# EAGLE design esp-wroom-test (EAGLE 9.6.2)
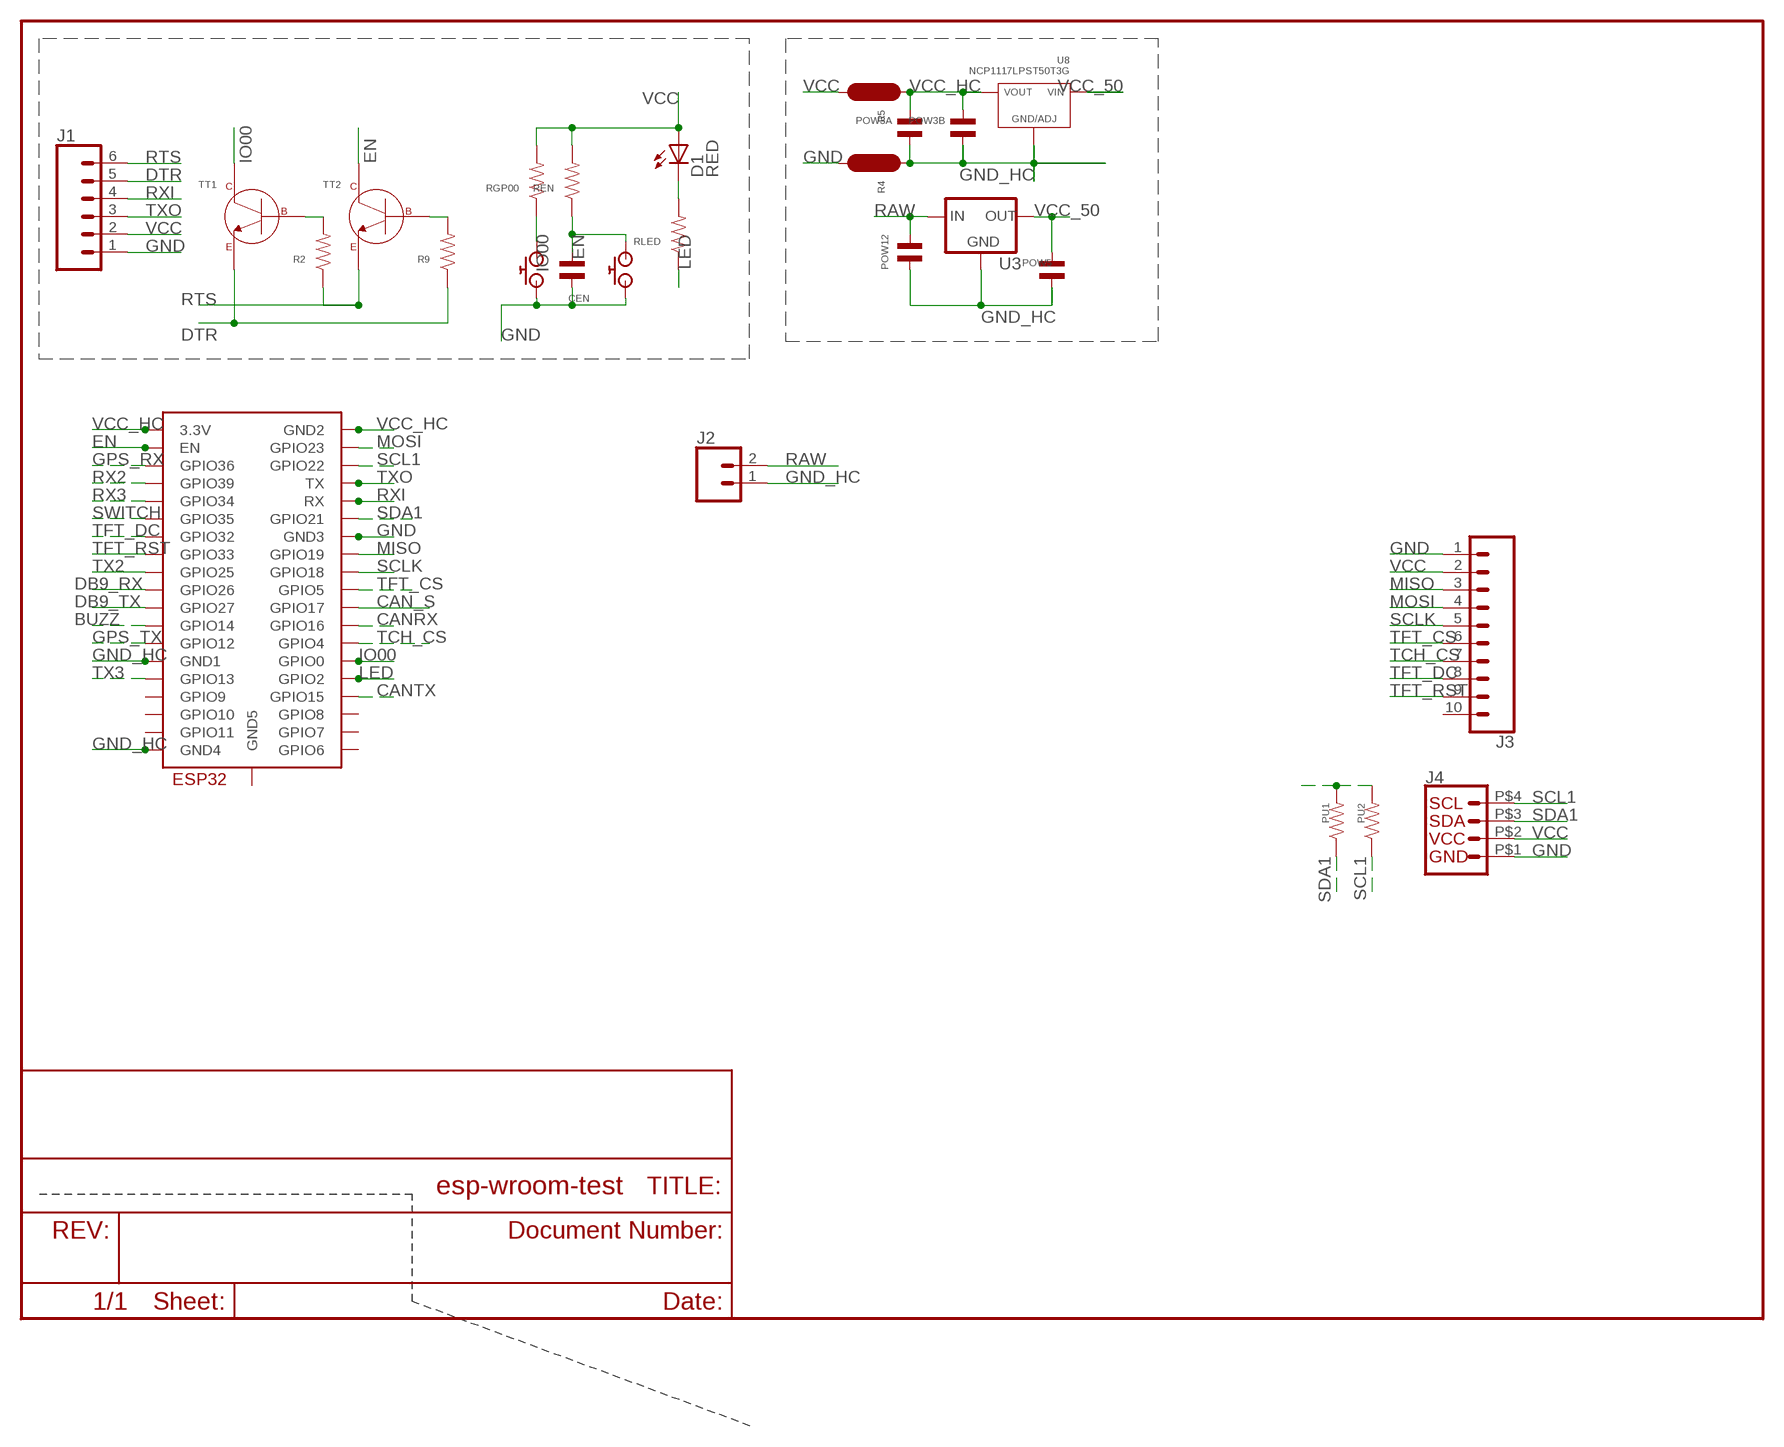
[diagram p0: schematic, sheet 1]

## Parts
CEN  CAPACITOR_NP_1206  [C1206]
D1  RED  LED-REDLILYPAD  [LED-1206]
J1  CONN_06  [1X6-1.25MM-SMD]
J2  CONN_02  [1X02]
J3  CONN_10  [1X10-1.25MM]
J4  Vertical Qwiic Connector  QWIIC_CONNECTORJST04_1MM_HOLE  [JST04_1MM_HOLES]
POW3A  CAPACITOR_NP_1206  [C1206]
POW3B  CAPACITOR_NP_1206  [C1206]
POW5  CAPACITOR_NP_1206  [C1206]
POW12  CAPACITOR_NP_1206  [C1206]
PU1  RESISTOR_1206  [R1206]
PU2  RESISTOR_1206  [R1206]
R2  RESISTOR_1206  [R1206]
R4  JUMPER  [R0603_JMP]
R5  JUMPER  [R0603_JMP]
R9  RESISTOR_1206  [R1206]
REN  RESISTOR_1206  [R1206]
RGP00  RESISTOR_1206  [R1206]
RLED  RESISTOR_1206  [R1206]
SW1  AMAZON_BUTTONB2010  [C2010]
SW2  AMAZON_BUTTONB2010  [C2010]
TT1  MF-DSC-SOT233-MMBT3904  NPN_BJTMMBT3904_SOT-23-3  [SOT-23-3]
TT2  MF-DSC-SOT233-MMBT3904  NPN_BJTMMBT3904_SOT-23-3  [SOT-23-3]
U3  V_REG_78XXSINK  [TO220-IGO]
U8  NCP1117LPST50T3G  [SOT-223-3]
U$3  ESP32-WROOM  [ESP32-WROOM]

## Nets
BUZZ: U$3.IO14(GPIO14)
CAN_S: U$3.IO17(GPIO17)
CANRX: U$3.IO16(GPIO16)
CANTX: U$3.IO15(GPIO15)
DB9_RX: U$3.IO26(GPIO26)
DB9_TX: U$3.IO27(GPIO27)
DTR: J1.5 R9.P$1 TT1.P$2(EMITTER)
EN: CEN.P$1 REN.P$1 SW1.P$1 TT2.P$3(COLLECTOR) U$3.EN
GND: CEN.P$2 J1.1 J3.1 J4.P$1 R4.P$2 SW1.P$2 SW2.P$2 U$3.GND3
GND_HC [hc]: J2.1 POW3A.P$2 POW3B.P$2 POW5.P$2 POW12.P$2 R4.P$1 U3.GND U8.P$2(GND/ADJ) U$3.GND1 U$3.GND4
GPS_RX: U$3.SENSOR_VP(GPIO36)
GPS_TX: U$3.IO12(GPIO12)
IO00: RGP00.P$1 SW2.P$1 TT1.P$3(COLLECTOR) U$3.IO0(GPIO0)
LED: RLED.P$1 U$3.IO2(GPIO2)
MISO: J3.3 U$3.IO19(GPIO19)
MOSI: J3.4 U$3.IO23(GPIO23)
N$2: D1.C RLED.P$2
N$3: R2.P$2 TT1.P$1(BASE)
N$6: R9.P$2 TT2.P$1(BASE)
RAW [hc]: J2.2 POW12.P$1 U3.IN
RTS: J1.6 R2.P$1 TT2.P$2(EMITTER)
RX2: U$3.SENSOR_VN(GPIO39)
RX3: U$3.IO34(GPIO34)
RXI: J1.4 U$3.RX
SCL1: J4.P$4 PU2.P$1 U$3.IO22(GPIO22)
SCLK: J3.5 U$3.IO18(GPIO18)
SDA1: J4.P$3 PU1.P$1 U$3.IO21(GPIO21)
SWITCH: U$3.IO35(GPIO35)
TCH_CS: J3.7 U$3.IO4(GPIO4)
TFT_CS: J3.6 U$3.IO5(GPIO5)
TFT_DC: J3.8 U$3.IO32(GPIO32)
TFT_RST: J3.9 U$3.IO33(GPIO33)
TX2: U$3.IO25(GPIO25)
TX3: U$3.IO13(GPIO13)
TXO: J1.3 U$3.TX
VCC: D1.A J1.2 J3.2 J4.P$2 PU1.P$2 PU2.P$2 R5.P$2 REN.P$2 RGP00.P$2
VCC_50 [hc]: POW5.P$1 U3.OUT U8.P$4(VIN)
VCC_HC [hc]: POW3A.P$1 POW3B.P$1 R5.P$1 U8.P$1(VOUT) U8.P$3(VOUT) U$3.3V3(3.3V) U$3.GND2
Unconnected: J3.10 U$3.CLK(GPIO6) U$3.CMD(GPIO11) U$3.GND5 U$3.SD0(GPIO7) U$3.SD1(GPIO8) U$3.SD2(GPIO9) U$3.SD3(GPIO10)

## Library data of the parts
CEN POW3A POW3B POW5 POW12 = MF_Passives:CAPACITOR_NP: Library: MF_Passives Description: Device for Non-Polarized Capacitors. Manufacture part number (MPN) can be added via Attributes. Check https://factory.macrofab.com/parts for the house parts list.; POPULATE: 1
D1 = 00jim:LED-RED: Assorted Red LEDs LilyPad 1206- DIO-09912 1206- DIO-00809 0603- DIO-00819; PROD_ID: DIO-09912
J1 = 00jim:CONN_06: Multi connection point. Often used as Generic Header-pin footprint for 0.1 inch spaced/style header connections On any of the 0.1 inch spaced packages, you can populate with these: Break Away Headers - Straight <https://www.sparkfun.com/products/116> (PRT-00116) Break Away Male Headers - Right Angle <https://www.sparkfun.com/products/553> (PRT-00553) Female Headers <https://www.sparkfun.com/products/115> (PRT-00115) Break Away Headers - Machine Pin <https://www.sparkfun.com/products/117> (PRT-00117) Break Away Female Headers - Swiss Machine Pin <https://www.sparkfun.com/products/743> (PRT-00743) Arduino Stackable Header - 6 Pin <https://www.sparkfun.com/products/9280> (PRT-09280) For SCREWTERMINALS and SPRING TERMINALS visit here: Screw Terimnals on SparkFun.com <https://www.sparkfun.com/search/results?term=Screw+Terminals> (5mm/3.5mm/2.54mm spacing) This device is also useful as a general connection point to wire up your design to another part of your project. Our various solder wires solder well into these plated through hole pads. Hook-Up Wire - Assortment (Stranded, 22 AWG) <https://www.sparkfun.com/products/11375> (PRT-11375) Hook-Up Wire - Assortment (Solid Core, 22 AWG) <https://www.sparkfun.com/products/11367> (PRT-11367) View the entire wire category on our website here <https://www.sparkfun.com/categories/141>
J2 = SparkFun-Connectors:CONN_02: Multi connection point. Often used as Generic Header-pin footprint for 0.1 inch spaced/style header connections On any of the 0.1 inch spaced packages, you can populate with these: Break Away Headers - Straight <https://www.sparkfun.com/products/116> (PRT-00116) Break Away Male Headers - Right Angle <https://www.sparkfun.com/products/553> (PRT-00553) Female Headers <https://www.sparkfun.com/products/115> (PRT-00115) Break Away Headers - Machine Pin <https://www.sparkfun.com/products/117> (PRT-00117) Break Away Female Headers - Swiss Machine Pin <https://www.sparkfun.com/products/743> (PRT-00743) For SCREWTERMINALS and SPRING TERMINALS visit here: Screw Terimnals on SparkFun.com <https://www.sparkfun.com/search/results?term=Screw+Terminals> (5mm/3.5mm/2.54mm spacing) This device is also useful as a general connection point to wire up your design to another part of your project. Our various solder wires solder well into these plated through hole pads. Hook-Up Wire - Assortment (Stranded, 22 AWG) <https://www.sparkfun.com/products/11375> (PRT-11375) Hook-Up Wire - Assortment (Solid Core, 22 AWG) <https://www.sparkfun.com/products/11367> (PRT-11367) View the entire wire category on our website here <https://www.sparkfun.com/categories/141> Special notes: Molex polarized connector foot print use with: PRT-08233 with associated crimp pins and housings. 2.54_SCREWTERM for use with PRT-10571. 3.5mm Screw Terminal footprints for PRT-08084 5mm Screw Terminal footprints for use with PRT-08432
J3 = SparkFun-Connectors:CONN_10: Multi connection point. Often used as Generic Header-pin footprint for 0.1 inch spaced/style header connections On any of the 0.1 inch spaced packages, you can populate with these: Break Away Headers - Straight <https://www.sparkfun.com/products/116> (PRT-00116) Break Away Male Headers - Right Angle <https://www.sparkfun.com/products/553> (PRT-00553) Female Headers <https://www.sparkfun.com/products/115> (PRT-00115) Break Away Headers - Machine Pin <https://www.sparkfun.com/products/117> (PRT-00117) Break Away Female Headers - Swiss Machine Pin <https://www.sparkfun.com/products/743> (PRT-00743) Arduino Stackable Header - 10 Pin <https://www.sparkfun.com/products/11376> (PRT-11376) For SCREWTERMINALS and SPRING TERMINALS visit here: Screw Terimnals on SparkFun.com <https://www.sparkfun.com/search/results?term=Screw+Terminals> (5mm/3.5mm/2.54mm spacing) This device is also useful as a general connection point to wire up your design to another part of your project. Our various solder wires solder well into these plated through hole pads. Hook-Up Wire - Assortment (Stranded, 22 AWG) <https://www.sparkfun.com/products/11375> (PRT-11375) Hook-Up Wire - Assortment (Solid Core, 22 AWG) <https://www.sparkfun.com/products/11367> (PRT-11367) View the entire wire category on our website here <https://www.sparkfun.com/categories/141> Special notes: Molex polarized connector foot print use with SKU : PRT-08231 with associated crimp pins and housings. 1MM SMD Version SKU: PRT-10208 NOTES ON THE VARIANTS LOCK and LOCK_LONGPADS... This footprint was designed to help hold the alignment of a through-hole component (i.e. 6-pin header) while soldering it into place. You may notice that each hole has been shifted either up or down by 0.005 of an inch from it's more standard position (which is a perfectly straight line). This slight alteration caused the pins (the squares in the middle) to touch the edges of the holes. Because they are alternating, it causes a "brace" to hold the component in place. 0.005 has proven to be the perfect amount of "off-center" position when using our standard breakaway headers. Although looks a little odd when you look at the bare footprint, once you have a header in there, the alteration is very hard to notice. Also,if you push a header all the way into place, it is covered up entirely on the bottom side.
J4 = 00jim:QWIIC_CONNECTOR: SparkFun I2C Standard Qwiic Connector An SMD 1mm pitch JST connector makes it easy and quick (get it? Qwiic?) to connect I2C devices to each other. The Qwiic system <http://www.sparkfun.com/qwiic> enables fast and solderless connection between popular platforms and various sensors and actuators. We carry 200mm <https://www.sparkfun.com/products/14204>, 100mm <https://www.sparkfun.com/products/14205>, 50mm <https://www.sparkfun.com/products/14206>, and breadboard friendly <https://www.sparkfun.com/products/14207> Qwiic cables. We also offer 10 pcs strips <https://www.sparkfun.com/products/14323> the SMD connectors.
PU1 PU2 R2 R9 REN RGP00 RLED = 00jim:RESISTOR: Library: MF_Passives Description: Device for Resistors. Manufacture part number (MPN), Voltage, Tolerance, and Wattage Rating can be added via Attributes. Check https://factory.macrofab.com/parts for the house parts list.; POPULATE: 1
R4 R5 = 00jim:JUMPER: Library: MF_Passives Description: Device for Resistors. Manufacture part number (MPN), Voltage, Tolerance, and Wattage Rating can be added via Attributes. Check https://factory.macrofab.com/parts for the house parts list.
SW1 SW2 = 00jim:AMAZON_BUTTON
TT1 TT2 = MF_Discrete_Semiconductor:NPN_BJT: Library: MF_Discrete_Semiconductor Description: Device for Single NPN BJT Transistors. Manufacture part number (MFG#) can be added via Attributes.; HOUSEPART: YES; MPN: MF-DSC-SOT233-MMBT3904; POPULATE: 1; URL: https://factory.macrofab.com/part/MF-DSC-SOT233-MMBT3904
U3 = SparkFun-IC-Power:V_REG_78XX: Voltage Regulator Standard 78xx regulator. IGO (Input Ground Output). Spark Fun Electronics SKU : COM-00107
U8 = MF_IC_Power:NCP1117LP: Manufacturer Part #: NCP1117LP Manufacturer: ON Semiconductor Description: LDO Voltage Regulators; HOUSEPART: NO; MPN: NCP1117LPST50T3G; POPULATE: 1; URL: http://www.onsemi.com/pub_link/Collateral/NCP1117LP-D.PDF
U$3 = ESP32:ESP32-WROOM

## Net classes
0 default: width 0.229 mm
1 vcc: width 0.254 mm
3 hc: width 0.508 mm

## Board
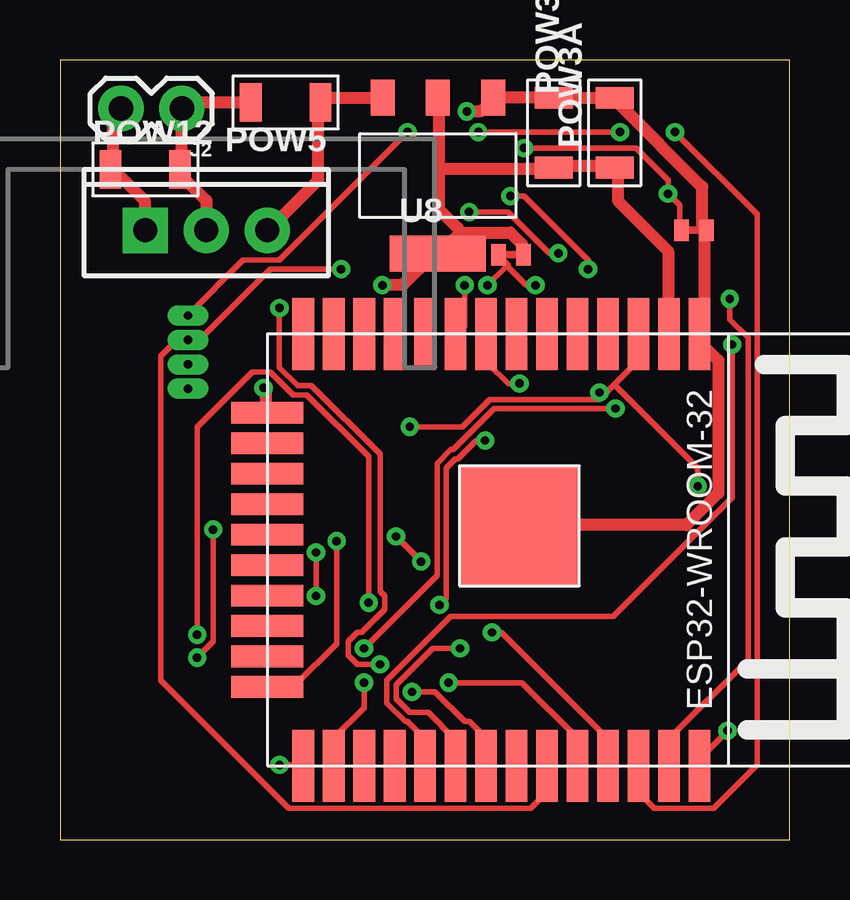
[diagram p1: board, top side]
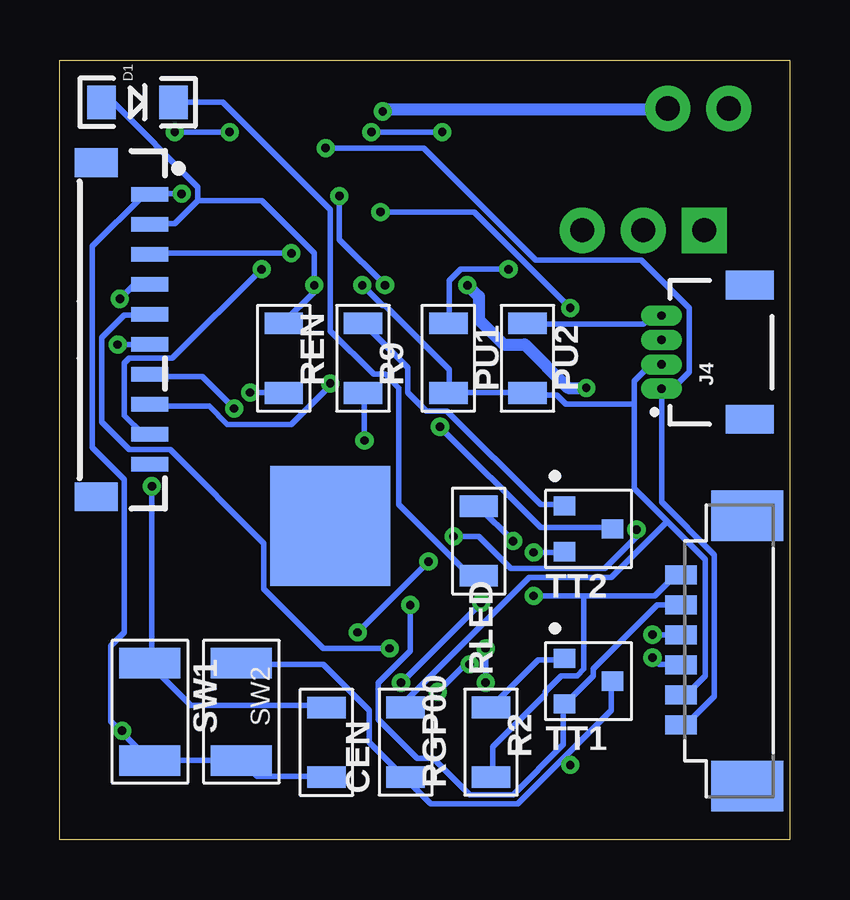
[diagram p2: board, bottom side, seen from below]

Size 30.4 x 32.5 mm. Coordinates in mm from the lower left corner, seen from the top.
Outline: 0,0 30.4,0 30.4,32.5 0,32.5 0,0
Copper layers (1*16): Top 0.035mm / dielectric 1.5mm / Bottom 0.035mm
Design rules "default *": minimum track width 6mil, minimum drill 0.35mm, track to track 6mil, track to pad 6mil, pad to pad 6mil, via to via 6mil, smd to smd 6mil, copper to edge 40mil, drill to drill 6mil, minimum pad ring 10mil, minimum via ring 8mil, stop-mask expansion 4mil, vias tented up to drill 30mil, thermal gap 10mil

### Footprints (pad centres in the part's own frame; a part is rotated, then mirrored left to right if it is on the bottom)
C1206 = smd 0.9 x 1.6: P$1 -1.45,0; P$2 1.45,0
LED-1206 = smd 1.2 x 1.4: A -1.5,0; C 1.5,0
1X6-1.25MM-SMD = smd 0.8 x 1.3: 1 -3.085,1.48; 2 -1.835,1.48; 3 -0.585,1.48; 4 0.665,1.48; 5 1.915,1.48; 6 3.165,1.48 | smd 2.1 x 3: NC1 -5.635,-1.27; NC2 5.635,-1.27
1X02 = drill 1.016 pad 1.88: 1 0,0; 2 2.54,0
1X10-1.25MM = smd 0.6 x 1.55: 1 -3.778,2.54; 2 -2.528,2.54; 3 -1.278,2.54; 4 -0.028,2.54; 5 1.222,2.54; 6 2.472,2.54; 7 3.722,2.54; 8 4.972,2.54; 9 6.222,2.54; 10 7.472,2.54 | smd 1.2 x 1.8: P$1 -5.11,0.315; P$3 8.822,0.315
JST04_1MM_HOLES = smd 1.2 x 2: NC1 2.8,0.135; NC2 -2.8,0.135 | drill 0.35 pad 0.61 long: P$1 -1.524,3.81; P$2 -0.508,3.81; P$3 0.508,3.81; P$4 1.524,3.81
R1206 = smd 0.9 x 1.6: P$1 -1.45,0; P$2 1.45,0
R0603_JMP = smd 0.6 x 0.9: P$1 0.52,0; P$2 -0.52,0
C2010 = smd 1.27 x 2.54: P$1 -2.032,0; P$2 2.032,0
SOT-23-3 = smd 0.9 x 0.8: P$1 -1,0.95; P$2 -1,-0.95; P$3 1,0
TO220-IGO = drill 1 pad 1.88: GND 0,0; OUT 2.54,0 | drill 1 pad 1.88 square: IN -2.54,0
SOT-223-3 = smd 1.5 x 4: P$1 3.25,0 | smd 1.5 x 1: P$2 -3.25,2.3; P$3 -3.25,0; P$4 -3.25,-2.3
ESP32-WROOM = smd 3 x 0.9: 3V3 0,16.74; EN 0,15.47; GND1 0,18.01; GND3 18,18.01; IO0 18,1.5; IO4 18,2.77; IO5 18,6.58; IO12 0,1.5; IO14 0,2.77; IO16 18,4.04; IO17 18,5.31; IO18 18,7.85; IO19 18,9.12; IO21 18,11.66; IO22 18,15.47; IO23 18,16.74; IO25 0,6.58; IO26 0,5.31; IO27 0,4.04; IO32 0,9.12; IO33 0,7.85; IO34 0,11.66; IO35 0,10.39; NC 18,10.39; RX 18,12.93; SENSOR_VN 0,12.93; SENSOR_VP 0,14.2; TX 18,14.2 | smd 0.9 x 3: CLK 9.635,0; CMD 8.365,0; GND2 3.285,0; IO2 14.715,0; IO13 4.555,0; IO15 13.445,0; SD0 10.905,0; SD1 12.175,0; SD2 5.825,0; SD3 7.095,0 | smd 5 x 5: GND4 8,10.5 | smd 5 x 5 bottom: GND5 8,10.5

### Placement (x,y rotation side)
CEN  19.3,4.05 270 bottom
D1  27.18,30.73 0 bottom
J1  3.05,7.87 90 bottom
J2  5.08,30.48 180 top
J3  29.21,23.11 270 bottom
J4  1.52,20.32 90 bottom
POW3A  23.11,29.46 90 top
POW3B  20.57,29.46 90 top
POW5  9.4,30.73 180 top
POW12  3.56,27.94 0 top
PU1  14.22,20.07 270 bottom
PU2  10.92,20.07 270 bottom
R2  12.45,4.06 90 bottom
R4  26.42,25.4 0 top
R5  18.8,24.38 0 top
R9  17.78,20.07 90 bottom
REN  21.08,20.07 90 bottom
RGP00  16,4.06 90 bottom
RLED  12.95,12.45 270 bottom
SW1  26.67,5.33 270 bottom
SW2  22.86,5.33 270 bottom
TT1  8.38,6.6 0 bottom
TT2  8.38,12.95 0 bottom
U3  6.1,25.4 0 top
U8  15.75,27.69 270 top
U$3  8.64,21.08 270 top

### Tracks (layer width: path | path; a pad name or v marks a point on that pad's centre or on a via)
DTR  (via drill 0.35)
  Top 0.229: v17.72,16.64 17.34,16.64 16.57,15.88 16.48,15.88 16.1,15.49 16.1,10.06 v15.81,9.78
  Bottom 0.229: J1.5 4.57,9.78 5.52,9.78 8.19,7.11 8.19,6.83 9.34,5.68 TT1.P$2 9.43,5.59 9.43,3.97 11.53,1.87 13.34,1.87 14.86,3.4 15.53,3.4 17.14,5.02 17.14,6.54 15.81,7.87 v15.81,9.78 | v17.72,16.64 17.72,18.54 R9.P$1
EN  (via drill 0.35)
  Top 0.229: v14.57,17.21 16.76,17.21 17.91,18.35 22.48,18.35 22.62,18.49 | 23.1,18.97 24.1,19.97 24.1,21.02 U$3.EN | 23.1,18.97 22.62,18.49 | 22.62,18.49 v22.48,18.64 | v26.57,14.73 26.57,15.49 23.1,18.97
  Bottom 0.229: CEN.P$1 19.34,5.59 24.96,5.59 26.67,7.3 SW1.P$1 26.57,7.4 v26.57,14.73 | v14.57,17.21 10.38,13.02 7.43,13.02 TT2.P$3 | v22.48,18.64 21.14,18.64 REN.P$1
GND  (via drill 0.35)
  Top 0.229: R4.P$2 25.81,25.4 25.81,26.45 v25.34,26.92 25.34,27.5 24,28.83 v19.34,28.83 | v27.81,4.54 26.67,3.4 26.67,3.11 U$3.GND3
  Bottom 0.229: J1.1 4.48,4.83 4.29,4.83 3.14,5.97 3.14,11.87 5.33,14.06 J4.P$1 5.24,18.83 4.86,18.83 4.19,19.5 4.19,22.16 6.19,24.16 10.57,24.16 15.24,28.83 v19.34,28.83 | CEN.P$2 19.34,2.63 22.19,2.63 SW2.P$2 SW1.P$2 27.86,4.49 | v25.34,26.92 26.67,26.92 J3.1 26.77,26.83 26.96,26.83 29.05,24.73 29.05,16.35 27.72,15.02 27.72,8.64 28.29,8.06 28.29,4.92 27.86,4.49 | v27.81,4.54 27.86,4.49
GND_HC  (via drill 0.35)
  Top 0.305: 25.91,25.4 26.92,25.4
  Top 0.508: POW5.P$2 5.33,30.73 J2.1 5.05,30.45 5.05,27.97 POW12.P$2 5.05,27.69 6.1,26.64 U3.GND | U$3.GND4 19.14,13.11 26.1,13.11 27.43,14.45 27.43,19.97 26.57,20.83 U$3.GND1 26.67,21.11 26.86,21.3 26.86,25.4 26.92,25.4 R4.P$1 26.77,25.59 26.77,27.21 23.24,30.73 POW3A.P$2 23.05,30.93 20.77,30.93 POW3B.P$2 18.1,30.93 U8.P$2 17.91,30.73 17.53,30.35 v16.95,30.35
  Bottom 0.508: v16.95,30.35 16.86,30.45 5.14,30.45 J2.1
IO00  (via drill 0.35)
  Top 0.229: v9.14,3.11 10.1,3.11 U$3.IO0
  Bottom 0.229: 9.43,3.4 11.34,1.49 14.95,1.49 16,2.54 RGP00.P$1 16.1,2.63 17.53,4.06 17.53,5.4 19.43,7.3 22.86,7.3 SW2.P$1 | 9.43,3.4 7.43,5.4 7.43,6.54 TT1.P$3 | 9.43,3.4 v9.14,3.11
LED  (via drill 0.35)
  Top 0.229: v11.53,12.45 11.53,8.16 9.81,6.45 8.67,6.45 U$3.IO2
  Bottom 0.229: v11.53,12.45 12.95,13.88 RLED.P$1
MISO  (via drill 0.35)
  Top 0.229: v20.77,24.45 20.38,24.45 18.67,26.16 v17.05,26.16 | v9.14,22.16 9.14,19.69 9.91,18.92 10.48,18.92 13.34,16.07 13.34,10.35 13.53,10.16 13.53,9.59 12.57,8.64 12.38,8.64 12,8.25 12,7.68 12.38,7.3 v13.34,7.3 | v14.67,6.16 15.62,6.16 16.86,4.92 17.05,4.92 17.72,4.25 17.72,3.11 U$3.IO19
  Bottom 0.229: v20.77,24.45 26.67,24.45 J3.3 | v17.05,26.16 13.14,26.16 v9.14,22.16 | v13.34,7.3 13.53,7.3 v14.67,6.16
MOSI  (via drill 0.35)
  Top 0.229: v27.91,22.54 27.91,21.69 28.67,20.92 28.67,7.49 25.43,4.25 25.43,3.11 U$3.IO23
  Bottom 0.229: v27.91,22.54 27.34,23.11 26.67,23.11 J3.4
N$1
  Top 0.305: 18.29,24.38 19.3,24.38
N$2
  Bottom 0.229: D1.C 23.62,30.73 19.14,26.26 19.14,21.21 17.34,19.4 16.86,19.4 16.29,18.83 16.29,13.97 13.34,11.02 12.95,11.02 RLED.P$2
N$3
  Bottom 0.229: TT1.P$1 9.43,7.49 10.48,7.49 12.38,5.59 R2.P$2
N$6
  Bottom 0.229: TT2.P$1 9.43,13.97 10.38,13.97 14.29,17.88 15.14,17.88 15.91,18.64 15.91,19.69 17.72,21.5 R9.P$2
RAW
  Top 0.508: J2.2 2.48,30.45 2.19,30.16 2.19,27.97 POW12.P$1 2.38,27.78 3.52,26.64 3.52,25.4 U3.IN
RTS  (via drill 0.35)
  Top 0.229: v10.67,10.16 v10.67,11.97
  Bottom 0.229: v10.67,11.97 9.43,11.97 TT2.P$2 | 8.57,10.16 5.62,10.16 4.76,11.02 4.57,11.02 J1.6 | 8.57,10.16 v10.67,10.16 | 8.57,10.16 8.57,7.11 8.86,6.83 9.53,6.83 10.19,6.16 10.19,6.06 12.38,3.87 12.38,2.63 R2.P$1
RXI  (via drill 0.35)
  Top 0.229: v5.71,8.54 5.71,17.21 8,19.5 8.76,19.5 9.72,18.54 10.29,18.54 12.86,15.97 v12.86,9.87 | v16.19,6.54 19.24,6.54 21.53,4.25 21.53,3.11 U$3.RX
  Bottom 0.229: v5.71,8.54 4.57,8.54 J1.4 | v16.19,6.54 v12.86,9.87
SCL1  (via drill 0.35)
  Top 0.229: v25.62,29.5 29.05,26.07 29.05,3.11 27.24,1.3 24.77,1.3 24.19,1.87 24.19,3.02 U$3.IO22 | v17.43,29.5 v23.34,29.5 | v14.48,29.5 9.14,24.16 7.62,24.16 5.33,21.88 J4.P$4
  Bottom 0.229: PU2.P$1 10.86,21.5 6.1,21.5 5.81,21.78 5.33,21.78 J4.P$4 | v23.34,29.5 v25.62,29.5 | v14.48,29.5 v17.43,29.5
SCLK  (via drill 0.35)
  Top 0.229: v16.67,7.97 15.53,7.97 14,6.45 14,5.87 14.57,5.3 15.34,5.3 16.48,4.16 16.48,3.11 U$3.IO18
  Bottom 0.229: v16.67,7.97 19.43,7.97 21.91,10.45 21.91,12.35 25.81,16.26 27.53,16.26 28.67,17.4 28.67,20.92 27.72,21.88 26.67,21.88 J3.5
SDA1  (via drill 0.35)
  Top 0.229: v11.72,23.78 8.76,23.78 5.81,20.83 J4.P$3 4.86,20.83 4.19,20.16 4.19,6.64 9.53,1.3 19.62,1.3 20.29,1.97 20.29,3.02 U$3.IO21
  Bottom 0.229: v11.72,23.78 13.72,23.78 14.19,23.3 14.19,21.59 PU1.P$1
TCH_CS  (via drill 0.35)
  Top 0.229: v23.15,17.97 18.1,17.97 16.38,16.26 16.29,16.26 15.72,15.68 15.72,11.02 v12.67,7.97 | v12.67,6.54 12.67,5.49 11.43,4.25 11.43,3.11 U$3.IO4
  Bottom 0.229: v23.15,17.97 24.48,19.3 26.67,19.3 J3.7 | v12.67,6.54 v12.67,7.97
TFT_CS  (via drill 0.35)
  Top 0.229: v28,20.64 28,14.26 23.05,9.3 16.29,9.3 13.62,6.64 13.62,5.68 14.38,4.92 14.48,4.92 15.14,4.25 15.14,3.11 U$3.IO5
  Bottom 0.229: v28,20.64 J3.6
TFT_DC  (via drill 0.35)
  Top 0.229: v19.14,19.02 18.67,19.02 17.81,19.88 17.81,21.02 U$3.IO32
  Bottom 0.229: v19.14,19.02 19.14,18.92 20.77,17.3 23.43,17.3 24.19,18.07 26.67,18.07 J3.8
TFT_RST  (via drill 0.35)
  Top 0.229: v22,23.78 22,24.16 19.34,26.83 v18.76,26.83 | v16.86,23.11 16.86,21.4 16.57,21.11 U$3.IO33
  Bottom 0.229: v22,23.78 25.72,20.07 27.53,20.07 27.72,19.88 27.72,17.69 26.96,16.92 26.67,16.92 J3.9 | v18.76,26.83 18.76,25.02 v16.86,23.11
TXO  (via drill 0.35)
  Top 0.229: v5.71,7.59 6.38,8.25 v6.38,12.92 | v15.05,11.59 v14,12.64 | v18,8.64 18.38,8.64 22.77,4.25 22.77,3.11 U$3.TX
  Bottom 0.229: v5.71,7.59 5.43,7.3 4.57,7.3 J1.3 | v6.38,12.92 6.38,12.64 7.71,11.3 11.62,11.3 12.95,12.64 v14,12.64 | v18,8.64 v15.05,11.59
VCC  (via drill 0.35)
  Top 0.229: 18.67,23.88 18.67,23.97 18.29,24.35 R5.P$2 | 18.67,23.88 19.43,23.11 v19.81,23.11 | v17.81,23.11 18.57,23.88 18.67,23.88
  Bottom 0.229: REN.P$2 21.05,21.59 19.81,22.83 v19.81,23.11 19.81,24.45 22,26.64 24.67,26.64 | D1.A 28.19,30.73 24.67,27.21 24.67,26.64 | 24.67,26.64 25.62,25.69 26.67,25.69 J3.2 | 5.1,13.26 6.48,14.64 6.48,18.16 | 5.1,13.26 3.52,11.68 3.52,6.83 4.29,6.06 4.48,6.06 J1.2 | 6.48,18.16 6.48,19.11 5.81,19.78 5.33,19.78 J4.P$2 | RGP00.P$2 16,5.78 10.86,10.92 7.43,10.92 5.1,13.26 | 6.48,18.16 9.34,18.16 9.72,18.54 10.86,18.54 PU2.P$2 10.95,18.64 14.19,18.64 PU1.P$2 14.19,18.73 14.19,19.59 16.86,22.26 16.95,22.26 v17.81,23.11
VCC_50
  Top 0.508: U8.P$4 13.43,30.93 11.05,30.93 POW5.P$1 10.76,30.54 10.76,27.5 8.67,25.4 U3.OUT
VCC_HC  (via drill 0.35)
  Top 0.508: 16.67,25.3 18.76,25.3 19.24,24.83 19.24,24.45 R5.P$1 | 16.67,25.3 15.81,24.45 U8.P$1 15.53,24.35 14.29,23.11 v13.43,23.11 | 15.81,27.97 15.81,26.26 16.57,25.5 16.67,25.3 | 15.81,27.97 15.81,30.93 U8.P$3 | 15.81,27.97 20.38,27.97 POW3B.P$1 20.57,28.07 23.05,28.07 POW3A.P$1 23.24,27.78 23.24,26.64 25.34,24.54 25.34,21.11 U$3.3V3 | v8.48,18.83 8.57,18.73 8.57,17.88 U$3.GND2
  Bottom 0.508: v8.48,18.83 9.24,18.83 11.05,20.64 11.91,20.64 12.95,21.69 12.95,22.64 v13.43,23.11